# Altium schematic sheet M2_NVME.SchDoc
size C; SheetNumber: 2; SheetTotal: 19
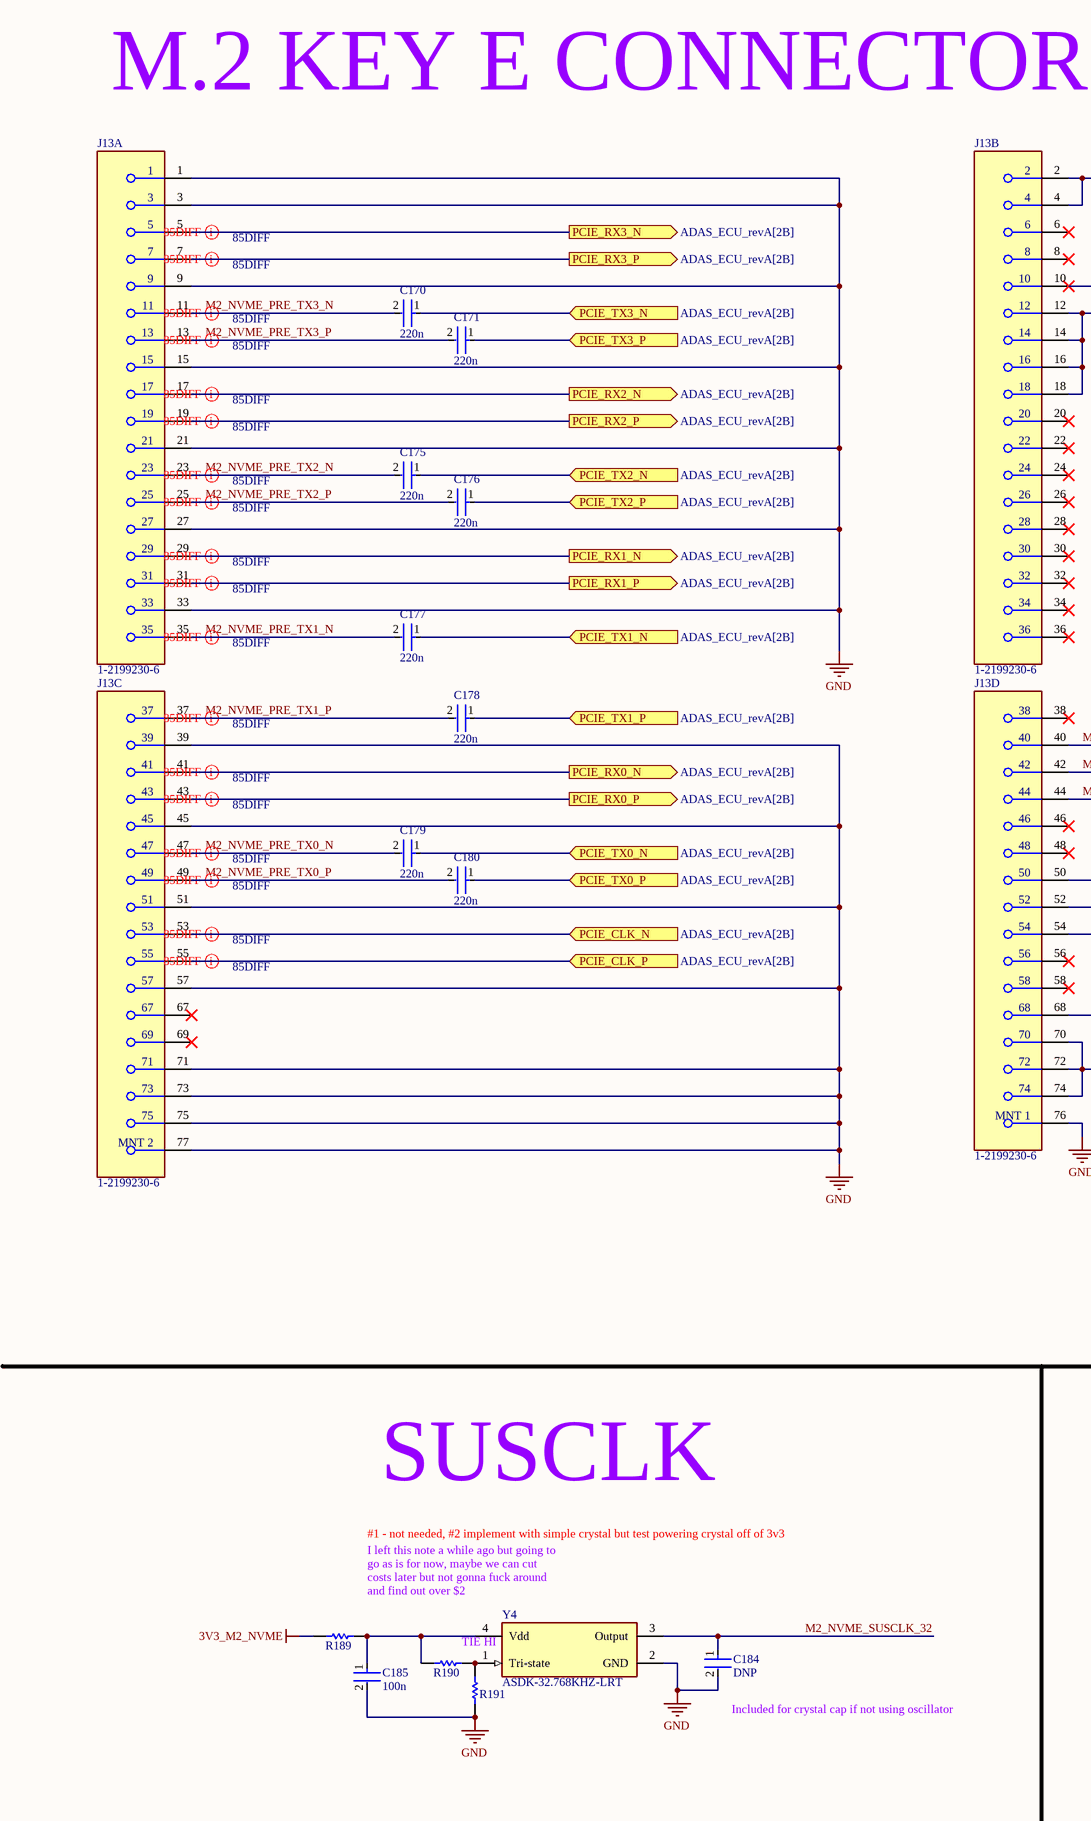
[diagram p0: M2_NVME.SchDoc, left]
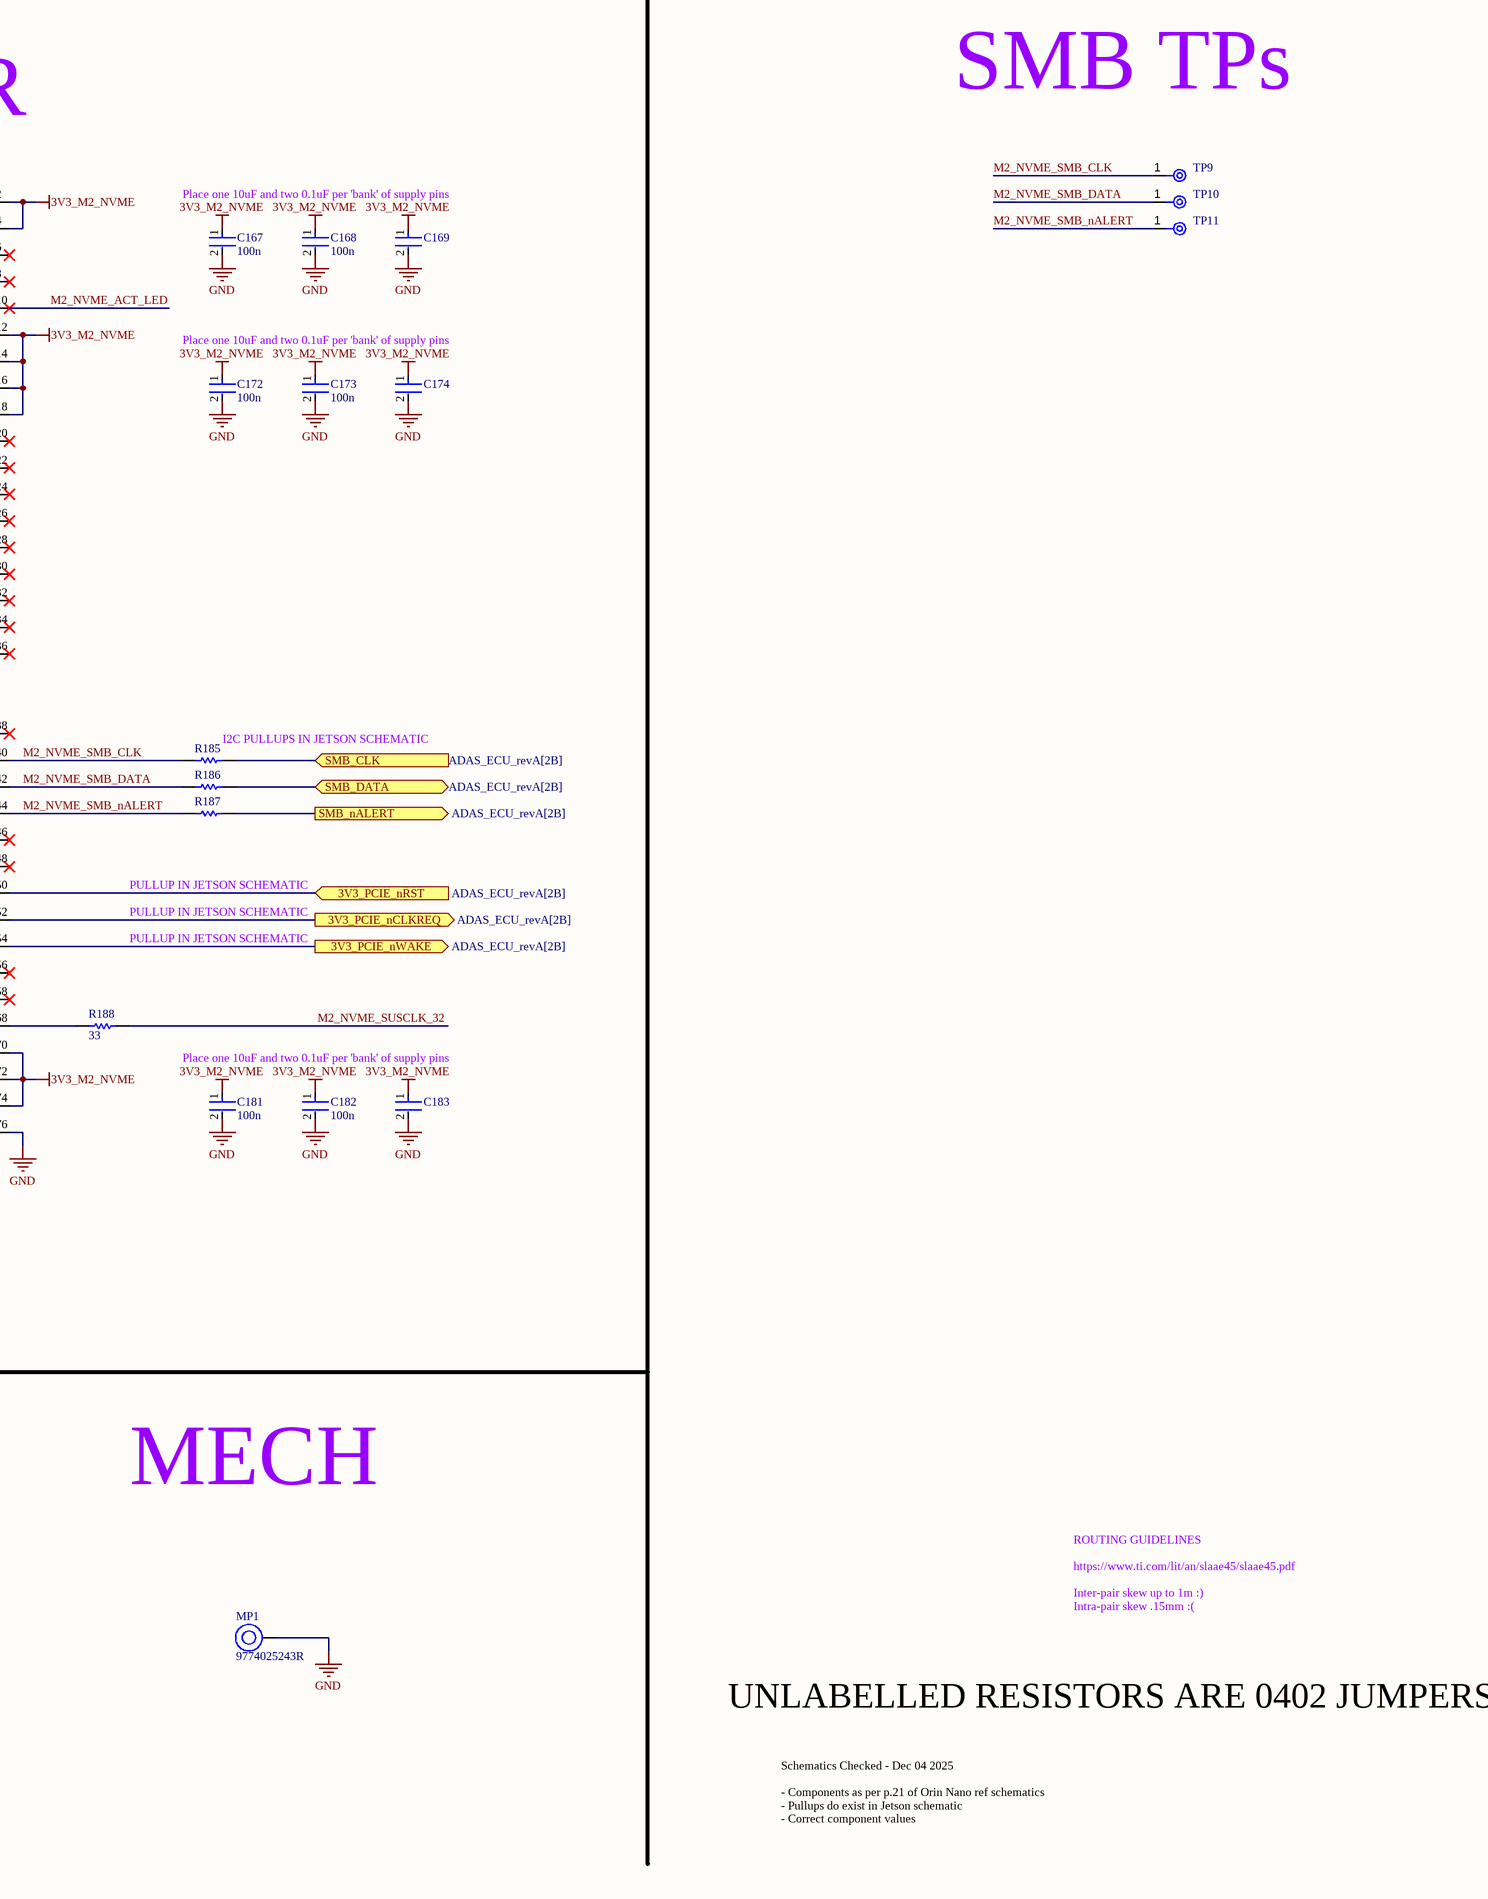
[diagram p1: M2_NVME.SchDoc, right]

## Parts
C167  100n  [FP-0402-L_1_0_0_05-W_0_5-IPC_A]
C168  100n  [FP-0402-L_1_0_0_05-W_0_5-IPC_A]
C169  GRM188R60J106ME47D  [FP-GRM188-0_1-e0_2_0_55-IPC_A]  (value not drawn)
C170  220n  [FP-0402-L_1_0_0_05-W_0_5-IPC_A]
C171  220n  [FP-0402-L_1_0_0_05-W_0_5-IPC_A]
C172  100n  [FP-0402-L_1_0_0_05-W_0_5-IPC_A]
C173  100n  [FP-0402-L_1_0_0_05-W_0_5-IPC_A]
C174  GRM188R60J106ME47D  [FP-GRM188-0_1-e0_2_0_55-IPC_A]  (value not drawn)
C175  220n  [FP-0402-L_1_0_0_05-W_0_5-IPC_A]
C176  220n  [FP-0402-L_1_0_0_05-W_0_5-IPC_A]
C177  220n  [FP-0402-L_1_0_0_05-W_0_5-IPC_A]
C178  220n  [FP-0402-L_1_0_0_05-W_0_5-IPC_A]
C179  220n  [FP-0402-L_1_0_0_05-W_0_5-IPC_A]
C180  220n  [FP-0402-L_1_0_0_05-W_0_5-IPC_A]
C181  100n  [FP-0402-L_1_0_0_05-W_0_5-IPC_A]
C182  100n  [FP-0402-L_1_0_0_05-W_0_5-IPC_A]
C183  GRM188R60J106ME47D  [FP-GRM188-0_1-e0_2_0_55-IPC_A]  (value not drawn)
C184  DNP  [FP-0402-L_1_0_0_05-W_0_5-IPC_A]
C185  100n  [FP-0402-L_1_0_0_05-W_0_5-IPC_A]
J13  1-2199230-6  [FP-1-2199230-6-MFG]  (parts A,B,C,D of 4)
MP1  9774025243R  [9774025243]
R185  DNP  [RESC1005X40X25ML05T05]  (value not drawn)
R186  DNP  [RESC1005X40X25ML05T05]  (value not drawn)
R187  DNP  [RESC1005X40X25ML05T05]  (value not drawn)
R188  33  [R0603B]
R189  0402 JUMPER  [RESC1005X40X25ML05T05]  (value not drawn)
R190  0402 JUMPER  [RESC1005X40X25ML05T05]  (value not drawn)
R191  DNP  [RESC1005X40X25ML05T05]  (value not drawn)
TP9  TPAD6R  [New footprint 1]  (value not drawn)
TP10  TPAD6R  [New footprint 1]  (value not drawn)
TP11  TPAD6R  [New footprint 1]  (value not drawn)
Y4  ASDK-32.768KHZ-LRT  [FP-ASDK-MFG]

## Ports
3V3_PCIE_nCLKREQ (out, see ADAS_ECU_revA[2B]), 3V3_PCIE_nRST (in, see ADAS_ECU_revA[2B]), 3V3_PCIE_nWAKE (out, see ADAS_ECU_revA[2B]), PCIE_CLK_N (in, see ADAS_ECU_revA[2B]), PCIE_CLK_P (in, see ADAS_ECU_revA[2B]), PCIE_RX0_N (out, see ADAS_ECU_revA[2B]), PCIE_RX0_P (out, see ADAS_ECU_revA[2B]), PCIE_RX1_N (out, see ADAS_ECU_revA[2B]), PCIE_RX1_P (out, see ADAS_ECU_revA[2B]), PCIE_RX2_N (out, see ADAS_ECU_revA[2B]), PCIE_RX2_P (out, see ADAS_ECU_revA[2B]), PCIE_RX3_N (out, see ADAS_ECU_revA[2B]), PCIE_RX3_P (out, see ADAS_ECU_revA[2B]), PCIE_TX0_N (in, see ADAS_ECU_revA[2B]), PCIE_TX0_P (in, see ADAS_ECU_revA[2B]), PCIE_TX1_N (in, see ADAS_ECU_revA[2B]), PCIE_TX1_P (in, see ADAS_ECU_revA[2B]), PCIE_TX2_N (in, see ADAS_ECU_revA[2B]), PCIE_TX2_P (in, see ADAS_ECU_revA[2B]), PCIE_TX3_N (in, see ADAS_ECU_revA[2B]), PCIE_TX3_P (in, see ADAS_ECU_revA[2B]), SMB_CLK (in, see ADAS_ECU_revA[2B]), SMB_DATA (bidir, see ADAS_ECU_revA[2B]), SMB_nALERT (out, see ADAS_ECU_revA[2B])

## Nets
3V3_M2_NVME: C167.1 C168.1 C169.1 C172.1 C173.1 C174.1 C181.1 C182.1 C183.1 J13.2 J13.4 J13.12 J13.14 J13.16 J13.18 J13.70 J13.72 J13.74 R189.1
GND: C167.2 C168.2 C169.2 C172.2 C173.2 C174.2 C181.2 C182.2 C183.2 C184.2 C185.2 J13.1 J13.3 J13.9 J13.15 J13.21 J13.27 J13.33 J13.39 J13.45 J13.51 J13.57 J13.71 J13.73 J13.75 J13.76(MNT_1) J13.77(MNT_2) MP1.1 R191.1 Y4.2(GND)
3V3_PCIE_nCLKREQ: J13.52 ; port 3V3_PCIE_nCLKREQ
3V3_PCIE_nRST: J13.50 ; port 3V3_PCIE_nRST
3V3_PCIE_nWAKE: J13.54 ; port 3V3_PCIE_nWAKE
M2_NVME_ACT_LED: J13.10
M2_NVME_PRE_TX0_N: C179.2 J13.47
M2_NVME_PRE_TX0_P: C180.2 J13.49
M2_NVME_PRE_TX1_N: C177.2 J13.35
M2_NVME_PRE_TX1_P: C178.2 J13.37
M2_NVME_PRE_TX2_N: C175.2 J13.23
M2_NVME_PRE_TX2_P: C176.2 J13.25
M2_NVME_PRE_TX3_N: C170.2 J13.11
M2_NVME_PRE_TX3_P: C171.2 J13.13
M2_NVME_SMB_CLK: J13.40 R185.1 TP9.1(TP)
M2_NVME_SMB_DATA: J13.42 R186.1 TP10.1(TP)
M2_NVME_SMB_nALERT: J13.44 R187.1 TP11.1(TP)
M2_NVME_SUSCLK_32: C184.1 R188.1 Y4.3(Output)
PCIE_CLK_N: J13.53 ; port PCIE_CLK_N
PCIE_CLK_P: J13.55 ; port PCIE_CLK_P
PCIE_RX0_N: J13.41 ; port PCIE_RX0_N
PCIE_RX0_P: J13.43 ; port PCIE_RX0_P
PCIE_RX1_N: J13.29 ; port PCIE_RX1_N
PCIE_RX1_P: J13.31 ; port PCIE_RX1_P
PCIE_RX2_N: J13.17 ; port PCIE_RX2_N
PCIE_RX2_P: J13.19 ; port PCIE_RX2_P
PCIE_RX3_N: J13.5 ; port PCIE_RX3_N
PCIE_RX3_P: J13.7 ; port PCIE_RX3_P
PCIE_TX0_N: C179.1 ; port PCIE_TX0_N
PCIE_TX0_P: C180.1 ; port PCIE_TX0_P
PCIE_TX1_N: C177.1 ; port PCIE_TX1_N
PCIE_TX1_P: C178.1 ; port PCIE_TX1_P
PCIE_TX2_N: C175.1 ; port PCIE_TX2_N
PCIE_TX2_P: C176.1 ; port PCIE_TX2_P
PCIE_TX3_N: C170.1 ; port PCIE_TX3_N
PCIE_TX3_P: C171.1 ; port PCIE_TX3_P
SMB_CLK: R185.2 ; port SMB_CLK
SMB_DATA: R186.2 ; port SMB_DATA
SMB_nALERT: R187.2 ; port SMB_nALERT
NetC185_1: C185.1 R189.2 R190.1 Y4.4(Vdd)
NetJ13_68: J13.68 R188.2
NetR190_2: R190.2 R191.2 Y4.1(Tri-state)

Not connected (* = marked no-connect by the designer): J13 6* 8* 20* 22* 24* 26* 28* 30* 32* 34* 36* 38* 46* 48* 56* 58* 67* 69*

## Layout directives
differential pair; differential pair class 85DIFF: M2_NVME_PRE_TX0_N, M2_NVME_PRE_TX0_P, M2_NVME_PRE_TX1_N, M2_NVME_PRE_TX1_P, M2_NVME_PRE_TX2_N, M2_NVME_PRE_TX2_P, M2_NVME_PRE_TX3_N, M2_NVME_PRE_TX3_P, PCIE_CLK_N, PCIE_CLK_P, PCIE_RX0_N, PCIE_RX0_P, PCIE_RX1_N, PCIE_RX1_P, PCIE_RX2_N, PCIE_RX2_P, PCIE_RX3_N, PCIE_RX3_P

## Notes on the sheet
- M.2 KEY E CONNECTOR
- SMB TPs
- Place one 10uF and two 0.1uF per 'bank' of supply pins
- (near R185) I2C PULLUPS IN JETSON SCHEMATIC
- PULLUP IN JETSON SCHEMATIC
- SUSCLK
- MECH
- #1 - not needed, #2 implement with simple crystal but test powering crystal off of 3v3
- I left this note a while ago but going to go as is for now, maybe we can cut costs later but not gonna fuck around and find out over $2
- (near Y4) TIE HI
- ROUTING GUIDELINES
  https://www.ti.com/lit/an/slaae45/slaae45.pdf
  Inter-pair skew up to 1m :)
  Intra-pair skew .15mm :(
- (near C184) Included for crystal cap if not using oscillator
- UNLABELLED RESISTORS ARE 0402 JUMPERS
- Schematics Checked - Dec 04 2025
  - Components as per p.21 of Orin Nano ref schematics
  - Pullups do exist in Jetson schematic
  - Correct component values

## Library data of the parts
C167 C168 C170-C173 C175-C182 C184 C185 = CMP-001-00058-1: LARGE PADS, 0402 CAP, CHANGE COMMENT TO MATCH REAL P/N; Capacitor Type: Ceramic; Min Operating Temperature: -55°C; Mounting Technology: Surface Mount; Pins: 2; Case/Package: 0402; RoHS Compliant: Yes; Max Operating Temperature: 85°C
C169 C174 C183 = CMP-2006-02792-2: Chip Multilayer Ceramic Capacitors for General Purpose, 0603, 10uF, X5R, 15%, 20%, 6.3V; Packaging: Tape and Reel; Voltage Rating (DC): 6.3V; Width: 0.031inch; Termination: SMD/SMT; Dielectric: X5R; Package Quantity: 4000; Voltage Rating: 6.3V; Capacitance: 10uF; Case/Package: 0603; Min Operating Temperature: -55°C; Voltage: 6.3V; Length: 1.6mm; Thickness: 0.035inch; Lead Free: Lead Free; Depth: 0.8mm; Case Code (Imperial): 0603; Max Operating Temperature: 85°C; Material: Ceramic; Height: 0.8mm; Tolerance: 20%; Mount: Surface Mount; REACH SVHC: No SVHC; Radiation Hardening: No; Case Code (Metric): 1608
J13 = CMP-03365-000001-1: CONN EDGE DUAL FMALE 67POS 0.020; Manufacturer: TE; Number Of Contacts: 67; Current Rating: 0.5A; Pitch: 0.5mm; Conn Gender: Female; Is Female: yes; Voltage Rating: 50V; Conn Orientation: Right Angle; Automotive: No; Temperature Range High: +80°C; Package: 1-2199230-6; Category: Conn; Temperature: -40°C to +80°C; Number Of Rows: 2; ComponentLink2URL: http://www.te.com/commerce/DocumentDelivery/DDEController?Action=showdoc&DocId=Specification+Or+Standard%7F114-115006%7FB%7Fpdf%7FEnglish%7FENG_SS_114-115006_B_114-115006_REV_B.pdf%7F1-2199230-6; Manufacturer Part Number: 1-2199230-6; Height: 4.2mm; RoHS: TRUE; Footprint Url: http://www.te.com/commerce/DocumentDelivery/DDEController?Action=showdoc&DocId=Customer+Drawing%7F2199230%7FB2%7Fpdf%7FEnglish%7FENG_CD_2199230_B2.pdf%7F1-2199230-6; Digikey Description: CONN EDGE DUAL FMALE 67POS 0.020; Device Class L2: Card Edge Connectors; Contact Material: Gold,Tin; Device Class L1: Connectors; Device Class L3: unset; ComponentLink2Description: Datasheet; Temperature Range Low: -40°C; Octopart: https://octopart.com/1-2199230-6-te+connectivity-34969376; Lead Free: Yes
MP1 = CMP-03913-59774857-1: 9774025243R Spacer Material: Steel, Tin-Plated Mounting: SMT Series: WA-SMST Thread D: M2; Outside Diameter: 4.3434mm; Threaded/Unthreaded: Threaded; Plating: Tin; REACH SVHC: Unknown; NexarPartId: 59774857; RoHS: Compliant; Material: Steel; Packaging: Tape and Reel; Max Operating Temperature: 150°C; Min Operating Temperature: -55°C; Length: 2.5mm; Height: 2.5mm
R185-R187 R189-R191 = CMP-009-00118-2: READ THE NAME; Pins: 2; Component Type: Standard; Design Item ID: CMP-009-00206-2; Source: 0402jump.SchLib
R188 = CMP-009-00002-14: Resistor
TP9-TP11 = CMP-00025-2: Test Point .6mm
Y4 = CMP-27762-001115-1: XTAL OSC XO 32.7680KHZ CMOS SMD; Load Capacitance: 15pF; Max Supply Current: 3.5mA; Min Supply Voltage: 2.97V; Operating Supply Voltage: 3.3V; Frequency Stability: 25ppm; Lead Free: Lead Free; Case/Package: CSMD; Number of Pins: 4; Max Operating Temperature: 85°C; Packaging: Tape and Reel; Width: 0.079inch; Min Operating Temperature: -40°C; Radiation Hardening: No; Length: 2.5mm; Depth: 2mm; Termination: SMD/SMT; Height: 0.037inch; Series: ASDK; Frequency: 32.768kHz; Mount: Surface Mount